# EAGLE design PCB2 1.1 (EAGLE 6.3)
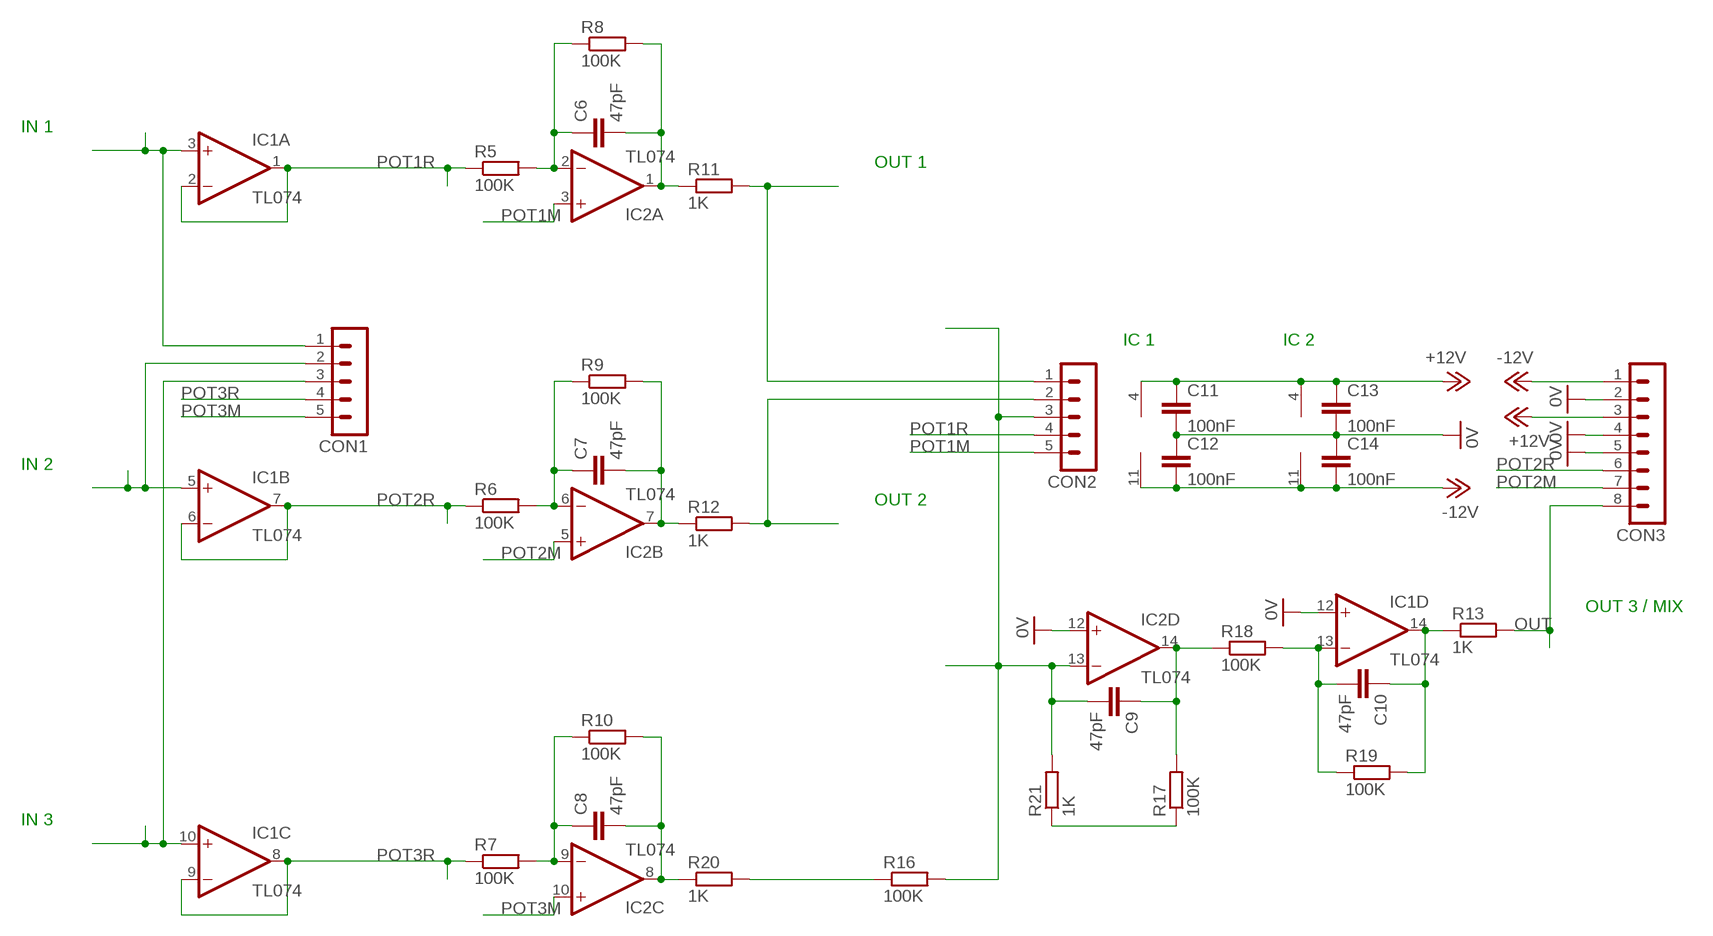
[diagram p0: schematic, sheet 1]

## Parts
C6  47pF  C-EU025-024X044  [C025-024X044]
C7  47pF  C-EU025-024X044  [C025-024X044]
C8  47pF  C-EU025-024X044  [C025-024X044]
C9  47pF  C-EU025-024X044  [C025-024X044]
C10  47pF  C-EU025-024X044  [C025-024X044]
C11  100nF  C-EU025-024X044  [C025-024X044]
C12  100nF  C-EU025-024X044  [C025-024X044]
C13  100nF  C-EU025-024X044  [C025-024X044]
C14  100nF  C-EU025-024X044  [C025-024X044]
CON1  MA05-1  [MA05-1]
CON2  MA05-1  [MA05-1]
CON3  MA08-1  [MA08-1]
IC1  TL074  TL074P  [DIL14]
IC2  TL074  TL074P  [DIL14]
R5  100K  R-EU_0207/10  [0207/9]
R6  100K  R-EU_0207/10  [0207/9]
R7  100K  R-EU_0207/10  [0207/9]
R8  100K  R-EU_0207/10  [0207/9]
R9  100K  R-EU_0207/10  [0207/9]
R10  100K  R-EU_0207/10  [0207/9]
R11  1K  R-EU_0207/10  [0207/9]
R12  1K  R-EU_0207/10  [0207/9]
R13  1K  R-EU_0207/10  [0207/9]
R16  100K  R-EU_0207/10  [0207/9]
R17  100K  R-EU_0207/10  [0207/9]
R18  100K  R-EU_0207/10  [0207/9]
R19  100K  R-EU_0207/10  [0207/9]
R20  1K  R-EU_0207/10  [0207/9]
R21  1K  R-EU_0207/10  [0207/9]

## Nets
0V: C11.2 C12.1 C13.2 C14.1 CON3.2 CON3.4 CON3.5 IC1.12(D:+IN) IC2.12(D:+IN)
+12V: C11.1 C13.1 CON3.3 IC1.4(P:V+) IC2.4(P:V+)
-12V: C12.2 C14.2 CON3.1 IC1.11(P:V-) IC2.11(P:V-)
N$3: R16.1 R20.2
N$9: CON1.1 IC1.3(A:+IN)
N$10: CON1.2 IC1.5(B:+IN)
N$11: CON1.3 IC1.10(C:+IN)
N$15: C6.1 IC2.2(A:-IN) R5.2 R8.1
N$19: CON2.1 R11.2
N$20: CON2.2 R12.2
N$21: C7.1 IC2.6(B:-IN) R6.2 R9.1
N$22: C8.1 IC2.9(C:-IN) R7.2 R10.1
N$23: C6.2 IC2.1(A:OUT) R8.2 R11.1
N$24: C7.2 IC2.7(B:OUT) R9.2 R12.1
N$25: C8.2 IC2.8(C:OUT) R10.2 R20.1
N$28: R17.1 R21.1
N$29: C9.1 IC2.14(D:OUT) R17.2 R18.1
N$30: C10.2 IC1.13(D:-IN) R18.2 R19.1
N$31: C10.1 IC1.14(D:OUT) R13.1 R19.2
N$33: C9.2 CON2.3 IC2.13(D:-IN) R16.2 R21.2
OUT: CON3.8 R13.2
POT1M: CON2.5 IC2.3(A:+IN)
POT1R: CON2.4 IC1.1(A:OUT) IC1.2(A:-IN) R5.1
POT2M: CON3.7 IC2.5(B:+IN)
POT2R: CON3.6 IC1.6(B:-IN) IC1.7(B:OUT) R6.1
POT3M: CON1.5 IC2.10(C:+IN)
POT3R: CON1.4 IC1.8(C:OUT) IC1.9(C:-IN) R7.1

## Notes on the sheet
- IN 1
- OUT 1
- IC 1 | IC 2
- IN 2
- OUT 2
- OUT 3 / MIX
- IN 3

## Library data of the parts
C6-C14 = Roll Your Own:C-EU: CAPACITOR, European symbol
CON1 CON2 = Roll Your Own:MA05-1: PIN HEADER; OC_FARNELL: unknown; OC_NEWARK: unknown
CON3 = Roll Your Own:MA08-1: PIN HEADER; OC_FARNELL: unknown; OC_NEWARK: unknown
IC1 IC2 = Roll Your Own:TL074: OP AMP
R5-R13 R16-R21 = Roll Your Own:R-EU_: RESISTOR, European symbol

## Board
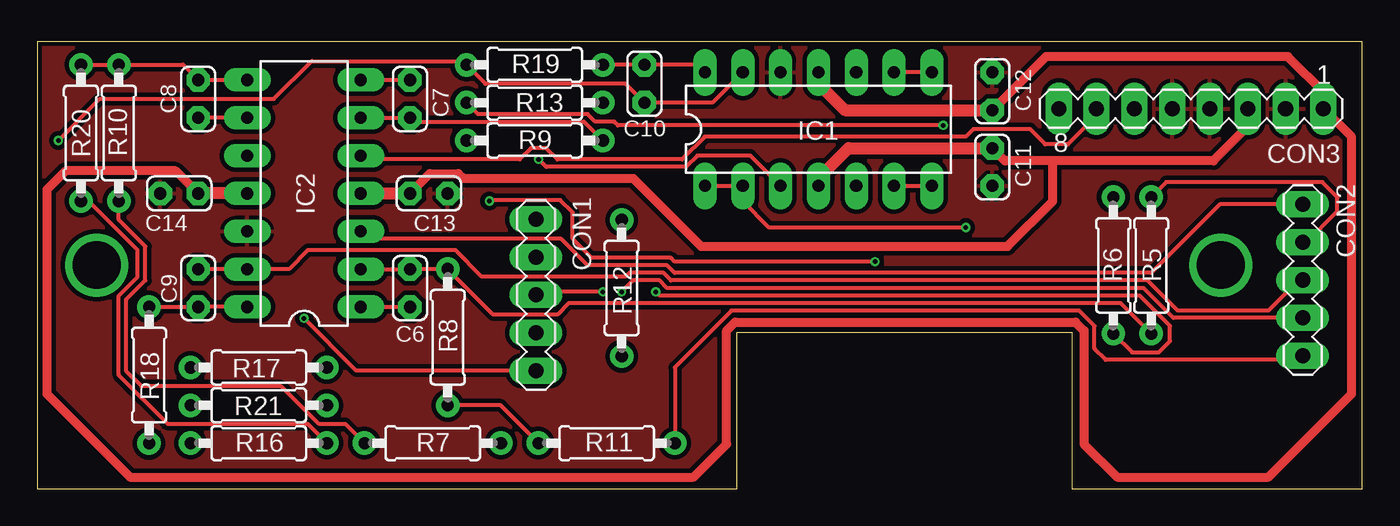
[diagram p1: board, top side]
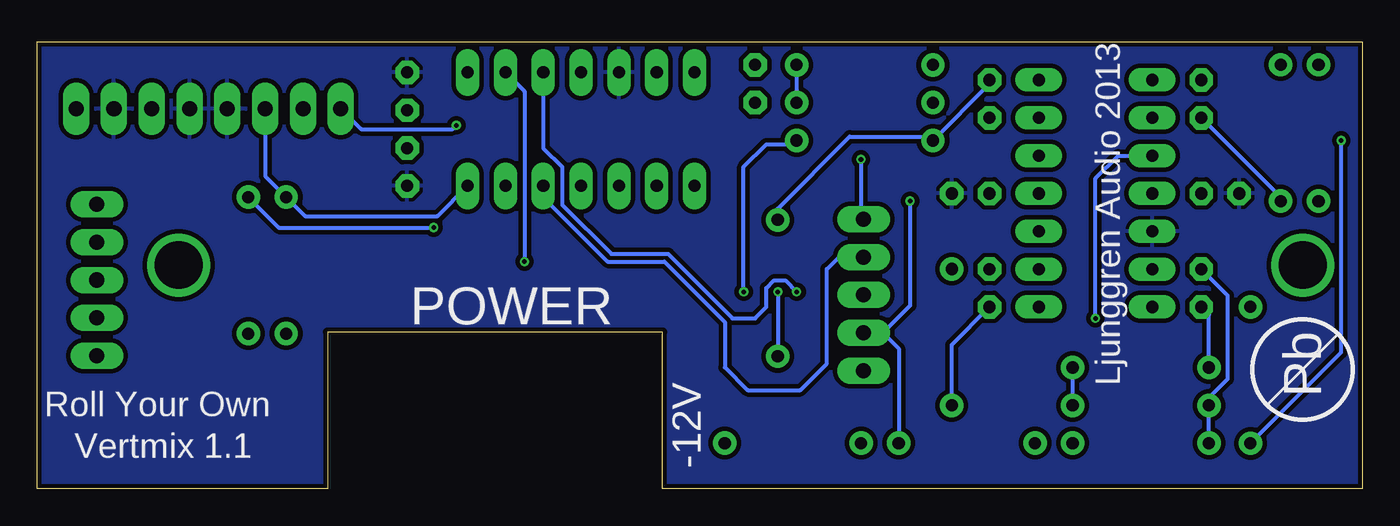
[diagram p2: board, bottom side, seen from below]

Size 89 x 30 mm. Coordinates in mm from the lower left corner, seen from the top.
Outline: 0,0 47,0 47,10.5 69.5,10.5 69.5,0 89,0 89,30 0,30 0,0
Copper layers (1*16): Top 0.035mm / dielectric 1.5mm / Bottom 0.035mm
Design rules "ITEADstudio_DRC 15 mil pads": minimum track width 6mil, minimum drill 12mil, track to track 6mil, track to pad 6mil, pad to pad 6mil, via to via 6mil, smd to smd 0mil, copper to edge 10mil, drill to drill 10mil, minimum pad ring 15mil, minimum via ring 6mil, stop-mask expansion 2mil, vias tented up to drill 100mil, thermal gap 10mil

### Footprints (pad centres in the part's own frame; a part is rotated, then mirrored left to right if it is on the bottom)
C025-024X044 = drill 0.813 octagon: 1 -1.27,0; 2 1.27,0
MA05-1 = drill 1.016 long: 1 -5.08,0; 2 -2.54,0; 3 0,0; 4 2.54,0; 5 5.08,0
MA08-1 = drill 1.016 long: 1 -8.89,0; 2 -6.35,0; 3 -3.81,0; 4 -1.27,0; 5 1.27,0; 6 3.81,0; 7 6.35,0; 8 8.89,0
DIL14 = drill 0.813 long: 1 -7.62,-3.81; 2 -5.08,-3.81; 3 -2.54,-3.81; 4 0,-3.81; 5 2.54,-3.81; 6 5.08,-3.81; 7 7.62,-3.81; 8 7.62,3.81; 9 5.08,3.81; 10 2.54,3.81; 11 0,3.81; 12 -2.54,3.81; 13 -5.08,3.81; 14 -7.62,3.81
0207/9 = drill 0.813: 1 -4.58,0; 2 4.58,0

### Placement (x,y rotation side)
C6  25.04,13.46 270 top
C7  25.04,26.16 90 top
C8  10.81,26.16 90 top
C9  10.81,13.46 90 top
C10  40.78,27.18 270 top
C11  64.15,21.59 270 top
C12  64.15,26.67 270 top
C13  26.31,19.81 0 top
C14  9.54,19.81 0 top
CON1  33.5,13 270 top
CON2  85,14 90 top
CON3  77.5,25.5 180 top
IC1  52.47,24.13 0 top
IC2  17.92,19.81 90 top
R5  74.82,14.99 270 top
R6  72.28,14.99 270 top
R7  26.56,3.05 180 top
R8  27.58,10.16 270 top
R9  33.42,23.37 180 top
R10  5.48,23.88 90 top
R11  38.24,3.05 0 top
R12  39.26,13.46 270 top
R13  33.42,25.91 180 top
R16  14.88,3.05 180 top
R17  14.88,8.13 180 top
R18  7.51,7.62 270 top
R19  33.42,28.45 0 top
R20  2.94,23.88 270 top
R21  14.88,5.59 180 top

### Tracks (layer width: path | path; a pad name or v marks a point on that pad's centre or on a via)
0V
  pour Bottom (isolate 0.305): 0,30.07 89.03,30.07 89.03,0 0,0
  pour Top (isolate 0.305): 0.1,30.07 89.03,30.07 89.03,0 -0.1,0 -0.1,30.18
+12V
  Top 0.61: CON3.3 81.31,24.31 79,22 68.22,22 | 68.22,22 65.01,22 C11.1 | C13.1 26.37,21.14 28.27,21.14 28.59,20.83 40.02,20.83 44.59,16.26 65.17,16.26 68.22,19.3 68.22,22
  Top 0.813: IC1.4 52.47,20.83 54.5,22.86 C11.1 | IC2.4 C13.1
-12V
  Top 0.61: 86.5,26.5 84,29 67.75,29 C12.2 | C14.2 9.29,21.34 1.92,21.34 0.65,20.07 0.65,6.35 6.24,0.76 44.09,0.76 46.31,2.98 46.31,10.6 46.88,11.18 69.74,11.18 70.31,10.6 70.31,2.98 72.53,0.76 82.69,0.76 88.28,6.35 88.28,23.61 CON3.1
  Top 0.813: CON3.1 86.5,25.61 86.5,26.5 | IC1.11 52.47,27.18 54.25,25.4 C12.2 | IC2.11 C14.2
N$1  (via drill 3.2)
  other vias: 4,15
N$3
  Top 0.254: R16.1 18.19,4.32 8.78,4.32 5.48,7.62 5.48,12.95 6.75,14.22 6.75,16 3.45,19.3 R20.2
N$9  (via drill 0.3)
  Top 0.254: IC1.3 47.9,22.35 44.34,22.35 43.58,21.59 34.18,21.59 v33.67,22.1
  Bottom 0.254: v33.67,22.1 33.67,18.25 CON1.1
N$10
  Bottom 0.254: IC1.5 55.01,19.56 50.69,15.24 46.88,15.24 42.82,11.18 42.82,8.13 41.29,6.6 37.74,6.6 35.96,8.38 35.96,14.73 35.15,15.54 CON1.2
N$11  (via drill 0.3)
  Top 0.254: v37.99,13.21 33.71,13.21 CON1.3
  Bottom 0.254: IC1.10 55.01,22.86 53.74,21.59 53.74,19.05 50.44,15.75 46.63,15.75 42.31,11.43 40.78,11.43 40.02,12.19 40.02,13.46 39.51,13.97 38.75,13.97 v37.99,13.21
N$15
  Top 0.254: R5.2 72.78,12.45 35.7,12.45 34.94,11.68 30.63,11.68 R8.1 27.57,14.73 C6.1 IC2.2
N$19
  Top 0.254: CON2.1 84.72,8.64 71.77,8.64 71.01,9.4 71.01,10.92 69.99,11.94 46.63,11.94 42.82,8.14 R11.2
N$20  (via drill 0.3)
  Top 0.254: CON2.2 76.31,11.46 74.31,13.46 42.31,13.46 41.8,13.97 40.02,13.97 v39.26,13.21
  Bottom 0.254: v39.26,13.21 R12.2
N$21  (via drill 0.3)
  Top 0.254: R6.2 73.54,9.14 75.33,9.14 76.09,9.91 76.09,10.92 74.06,12.95 41.8,12.95 v41.55,13.21 | IC2.6 C7.1 25.29,24.64 36.73,24.64 R9.1
  Bottom 0.254: v41.55,13.21 41.55,21.59 40.02,23.11 38.25,23.11 R9.1
N$22
  Top 0.254: IC2.9 C8.1 | R7.2 20.71,4.32 18.94,4.32 16.4,6.86 7,6.86 5.99,7.87 5.99,12.7 7.26,13.97 7.26,16.26 5.48,18.03 R10.1
  Bottom 0.254: C8.1 5.48,19.56 R10.1
N$23
  Top 0.254: R11.1 31.13,5.58 R8.2 | IC2.1 C6.2
  Bottom 0.254: R8.2 27.58,9.65 C6.2
N$24
  Top 0.254: IC2.7 C7.2
  Bottom 0.254: C7.2 25.04,27.17 R9.2 29.1,23.62 34.43,23.62 39.26,18.8 R12.1
N$25
  Top 0.254: R20.1 R10.2 9.79,28.46 C8.2 IC2.8
N$28
  Bottom 0.254: R17.1 R21.1
N$29
  Top 0.254: R18.1 C9.1 IC2.14
  Bottom 0.254: R17.2 10.3,11.68 C9.1
N$30  (via drill 0.3)
  Top 0.254: IC1.13 45.36,25.91 C10.2 39.51,27.18 30.11,27.18 R19.1 28.59,28.45 28.34,28.7 18.43,28.7 15.89,26.16 4.21,26.16 v1.41,23.37
  Bottom 0.254: R18.2 1.41,9.14 v1.41,23.37
N$31
  Top 0.254: IC1.14 44.34,28.45 C10.1 R19.2
  Bottom 0.254: R19.2 R13.1
N$32  (via drill 3.2)
  other vias: 79.5,15
N$33
  Top 0.254: CON2.3 84.97,13.97 84.73,13.97 82.69,11.94 76.6,11.94 74.57,13.97 42.56,13.97 42.05,14.48 39.77,14.48 39.51,14.22 29.86,14.22 28.08,16 18.18,16 16.91,14.73 IC2.13 C9.2
  Bottom 0.254: R16.2 R21.2 10.3,6.1 9.03,7.37 9.03,12.95 C9.2
OUT  (via drill 0.3)
  Top 0.254: v60.85,24.38 39.01,24.38 38.75,24.64 37.48,24.64 36.97,25.15 29.6,25.15 R13.2
  Bottom 0.254: CON3.8 67.24,24.13 61.1,24.13 v60.85,24.38
POT1M
  Top 0.254: CON2.5 79.42,19.08 74.82,14.48 42.82,14.48 42.31,14.99 36.97,14.99 35.2,16.76 22.24,16.76 IC2.3
POT1R  (via drill 0.3)
  Top 0.254: CON2.4 85.26,16.54 87.27,18.54 87.33,18.62 87.33,19.56 86.31,20.57 75.83,20.57 R5.1 | v62.37,17.53 49.17,17.53 47.39,19.3 IC1.2 IC1.1
  Bottom 0.254: R5.1 72.78,17.53 v62.37,17.53
POT2M
  Top 0.254: CON3.7 71.01,25.36 71.01,24.89 69.23,23.11 67.71,23.11 66.69,24.13 62.88,24.13 62.37,23.62 44.85,23.62 43.32,22.1 34.94,22.1 34.18,22.86 33.16,22.86 32.4,22.1 21.99,22.1 IC2.5
POT2R
  Top 0.254: IC1.6 IC1.7
  Bottom 0.254: CON3.6 73.69,20.98 R6.1 71,18.29 62.12,18.29 IC1.7
POT3M  (via drill 0.3)
  Top 0.254: CON1.5 21.43,7.92 v17.92,11.43
  Bottom 0.254: v17.92,11.43 17.92,20.83 16.4,22.35 IC2.10
POT3R  (via drill 0.3)
  Top 0.254: IC1.8 IC1.9 | v56.28,15.24 42.82,15.24 42.56,15.49 37.23,15.49 35.96,16.76 35.96,18.54 35.13,19.37 30.43,19.37 v30.37,19.3
  Bottom 0.254: CON1.4 32.19,10.46 | 32.19,10.46 31.13,9.4 R7.1 | IC1.9 56.28,26.67 v56.28,15.24 | v30.37,19.3 30.37,12.28 32.19,10.46

### Text on the board
bPlace: Ljunggren Audio 2013 | POWER | Pb | Roll Your Own | Vertmix 1.1 | -12V